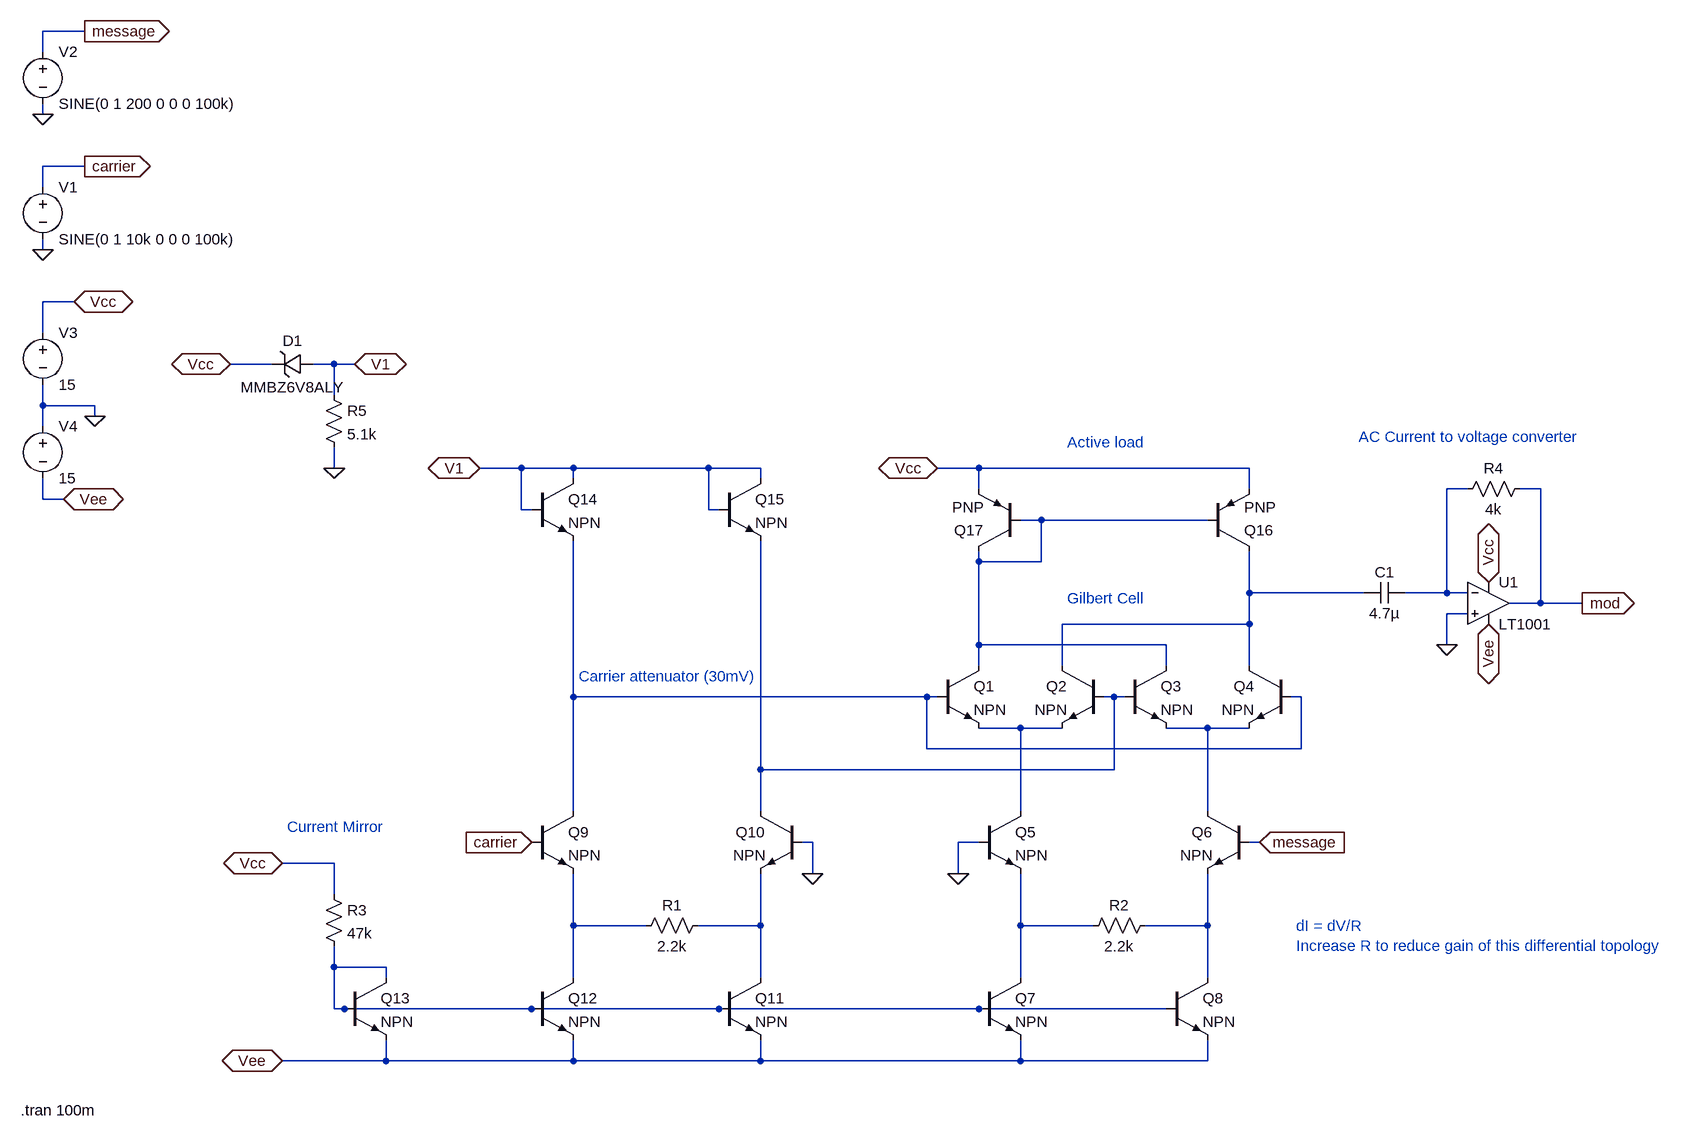
[diagram p0: schematic gilbert_cell_improved.asc]
gilbert_cell_improved.asc, the LTspice schematic file:
Version 4
SHEET 1 1336 812
WIRE -1152 -864 -1216 -864
WIRE -1216 -832 -1216 -864
WIRE -1216 -736 -1216 -752
WIRE -1152 -656 -1216 -656
WIRE -1216 -624 -1216 -656
WIRE -1216 -528 -1216 -544
WIRE -1168 -448 -1216 -448
WIRE -1216 -400 -1216 -448
WIRE -864 -352 -928 -352
WIRE -768 -352 -800 -352
WIRE -736 -352 -768 -352
WIRE -768 -304 -768 -352
WIRE -1216 -288 -1216 -320
WIRE -1136 -288 -1216 -288
WIRE -1136 -272 -1136 -288
WIRE -1216 -256 -1216 -288
WIRE -768 -192 -768 -224
WIRE -480 -192 -544 -192
WIRE -400 -192 -480 -192
WIRE -192 -192 -400 -192
WIRE -112 -192 -192 -192
WIRE 224 -192 160 -192
WIRE 640 -192 224 -192
WIRE -400 -176 -400 -192
WIRE -112 -176 -112 -192
WIRE 224 -160 224 -192
WIRE 640 -160 640 -192
WIRE 976 -160 944 -160
WIRE 1088 -160 1056 -160
WIRE -1216 -144 -1216 -176
WIRE -1184 -144 -1216 -144
WIRE -480 -128 -480 -192
WIRE -464 -128 -480 -128
WIRE -192 -128 -192 -192
WIRE -176 -128 -192 -128
WIRE 320 -112 288 -112
WIRE 576 -112 320 -112
WIRE 224 -48 224 -64
WIRE 320 -48 320 -112
WIRE 320 -48 224 -48
WIRE 640 0 640 -64
WIRE 816 0 640 0
WIRE 944 0 944 -160
WIRE 944 0 880 0
WIRE 976 0 944 0
WIRE 1088 16 1088 -160
WIRE 1088 16 1040 16
WIRE 1152 16 1088 16
WIRE 976 32 944 32
WIRE 640 48 640 0
WIRE 640 48 352 48
WIRE 224 80 224 -48
WIRE 512 80 224 80
WIRE 944 80 944 32
WIRE 224 112 224 80
WIRE 352 112 352 48
WIRE 512 112 512 80
WIRE 640 112 640 48
WIRE -400 160 -400 -80
WIRE 144 160 -400 160
WIRE 160 160 144 160
WIRE 432 160 416 160
WIRE 448 160 432 160
WIRE 720 160 704 160
WIRE 288 208 224 208
WIRE 352 208 288 208
WIRE 576 208 512 208
WIRE 640 208 576 208
WIRE 144 240 144 160
WIRE 720 240 720 160
WIRE 720 240 144 240
WIRE -112 272 -112 -80
WIRE 432 272 432 160
WIRE 432 272 -112 272
WIRE -400 336 -400 160
WIRE -112 336 -112 272
WIRE 288 336 288 208
WIRE 576 336 576 208
WIRE -32 384 -48 384
WIRE 224 384 192 384
WIRE 656 384 640 384
WIRE -768 416 -848 416
WIRE -32 432 -32 384
WIRE 192 432 192 384
WIRE -768 464 -768 416
WIRE -400 512 -400 432
WIRE -288 512 -400 512
WIRE -112 512 -112 432
WIRE -112 512 -208 512
WIRE 288 512 288 432
WIRE 400 512 288 512
WIRE 576 512 576 432
WIRE 576 512 480 512
WIRE -768 576 -768 544
WIRE -688 576 -768 576
WIRE -688 592 -688 576
WIRE -400 592 -400 512
WIRE -112 592 -112 512
WIRE 288 592 288 512
WIRE 576 592 576 512
WIRE -768 640 -768 576
WIRE -752 640 -768 640
WIRE -464 640 -752 640
WIRE -176 640 -464 640
WIRE 224 640 -176 640
WIRE 512 640 224 640
WIRE -688 720 -688 688
WIRE -688 720 -848 720
WIRE -400 720 -400 688
WIRE -400 720 -688 720
WIRE -112 720 -112 688
WIRE -112 720 -400 720
WIRE 288 720 288 688
WIRE 288 720 -112 720
WIRE 576 720 576 688
WIRE 576 720 288 720
FLAG -32 432 0
FLAG 192 432 0
FLAG -1136 -272 0
FLAG -1184 -144 Vee
IOPIN -1184 -144 BiDir
FLAG -1168 -448 Vcc
IOPIN -1168 -448 BiDir
FLAG -1216 -736 0
FLAG -1216 -528 0
FLAG -1152 -864 message
IOPIN -1152 -864 Out
FLAG -1152 -656 carrier
IOPIN -1152 -656 Out
FLAG -736 -352 V1
IOPIN -736 -352 BiDir
FLAG -544 -192 V1
IOPIN -544 -192 BiDir
FLAG 160 -192 Vcc
IOPIN 160 -192 BiDir
FLAG -848 720 Vee
IOPIN -848 720 BiDir
FLAG -848 416 Vcc
IOPIN -848 416 BiDir
FLAG 656 384 message
IOPIN 656 384 In
FLAG -464 384 carrier
IOPIN -464 384 In
FLAG 1008 -16 Vcc
IOPIN 1008 -16 BiDir
FLAG 1008 48 Vee
IOPIN 1008 48 BiDir
FLAG 944 80 0
FLAG 1152 16 mod
IOPIN 1152 16 Out
FLAG -768 -192 0
FLAG -928 -352 Vcc
IOPIN -928 -352 BiDir
SYMBOL npn 160 112 R0
SYMATTR InstName Q1
SYMBOL npn 416 112 M0
SYMATTR InstName Q2
SYMBOL npn 448 112 R0
SYMATTR InstName Q3
SYMBOL npn 704 112 M0
SYMATTR InstName Q4
SYMBOL npn 224 336 R0
SYMATTR InstName Q5
SYMBOL npn 640 336 M0
SYMATTR InstName Q6
SYMBOL npn 224 592 R0
SYMATTR InstName Q7
SYMBOL npn -464 336 R0
SYMATTR InstName Q9
SYMBOL npn -48 336 M0
SYMATTR InstName Q10
SYMBOL npn 512 592 R0
SYMATTR InstName Q8
SYMBOL npn -176 592 R0
SYMATTR InstName Q11
SYMBOL npn -464 592 R0
SYMATTR InstName Q12
SYMBOL npn -752 592 R0
SYMATTR InstName Q13
SYMBOL res -192 496 R90
WINDOW 0 0 56 VBottom 2
WINDOW 3 32 56 VTop 2
SYMATTR InstName R1
SYMATTR Value 2.2k
SYMBOL res 496 496 R90
WINDOW 0 0 56 VBottom 2
WINDOW 3 32 56 VTop 2
SYMATTR InstName R2
SYMATTR Value 2.2k
SYMBOL npn -464 -176 R0
SYMATTR InstName Q14
SYMBOL npn -176 -176 R0
SYMATTR InstName Q15
SYMBOL pnp 576 -64 M180
SYMATTR InstName Q16
SYMBOL pnp 288 -64 R180
SYMATTR InstName Q17
SYMBOL res -784 448 R0
SYMATTR InstName R3
SYMATTR Value 47k
SYMBOL voltage -1216 -640 R0
WINDOW 123 0 0 Left 0
WINDOW 39 0 0 Left 0
SYMATTR InstName V1
SYMATTR Value SINE(0 1 10k 0 0 0 100k)
SYMBOL voltage -1216 -416 R0
WINDOW 123 0 0 Left 0
WINDOW 39 0 0 Left 0
SYMATTR InstName V3
SYMATTR Value 15
SYMBOL voltage -1216 -272 R0
WINDOW 123 0 0 Left 0
WINDOW 39 0 0 Left 0
SYMATTR InstName V4
SYMATTR Value 15
SYMBOL voltage -1216 -848 R0
WINDOW 123 0 0 Left 0
WINDOW 39 0 0 Left 0
SYMATTR InstName V2
SYMATTR Value SINE(0 1 200 0 0 0 100k)
SYMBOL cap 880 -16 R90
WINDOW 0 0 32 VBottom 2
WINDOW 3 32 32 VTop 2
SYMATTR InstName C1
SYMATTR Value 4.7µ
SYMBOL OpAmps\\LT1001 1008 -48 R0
SYMATTR InstName U1
SYMBOL res 1072 -176 R90
WINDOW 0 0 56 VBottom 2
WINDOW 3 32 56 VTop 2
SYMATTR InstName R4
SYMATTR Value 4k
SYMBOL zener -800 -368 R90
WINDOW 0 -4 32 VBottom 2
WINDOW 3 36 32 VTop 2
SYMATTR InstName D1
SYMATTR Value MMBZ6V8ALY
SYMBOL res -784 -320 R0
SYMATTR InstName R5
SYMATTR Value 5.1k
TEXT -1250 796 Left 2 !.tran 100m
TEXT -840 360 Left 2 ;Current Mirror
TEXT -392 128 Left 2 ;Carrier attenuator (30mV)
TEXT 360 8 Left 2 ;Gilbert Cell
TEXT 360 -232 Left 2 ;Active load
TEXT 808 -240 Left 2 ;AC Current to voltage converter
TEXT 712 512 Left 2 ;dI = dV/R\nIncrease R to reduce gain of this differential topology

The netlist it stands for:
* gilbert_cell_improved.asc
Q1 N002 N004 N006 0 NPN
Q2 N003 N005 N006 0 NPN
Q3 N002 N005 N007 0 NPN
Q4 N003 N004 N007 0 NPN
Q5 N006 0 N010 0 NPN
Q6 N007 message N011 0 NPN
Q7 N010 N012 Vee 0 NPN
Q9 N004 carrier N008 0 NPN
Q10 N005 0 N009 0 NPN
Q8 N011 N012 Vee 0 NPN
Q11 N009 N012 Vee 0 NPN
Q12 N008 N012 Vee 0 NPN
Q13 N012 N012 Vee 0 NPN
R1 N009 N008 2.2k
R2 N011 N010 2.2k
Q14 V1 V1 N004 0 NPN
Q15 V1 V1 N005 0 NPN
Q16 N003 N002 Vcc 0 PNP
Q17 N002 N002 Vcc 0 PNP
R3 Vcc N012 47k
V1 carrier 0 SINE(0 1 10k 0 0 0 100k)
V3 Vcc 0 15
V4 0 Vee 15
V2 message 0 SINE(0 1 200 0 0 0 100k)
C1 N001 N003 4.7µ
XU1 0 N001 Vcc Vee mod LT1001  ; pins In+ In- V+ V- OUT
R4 mod N001 4k
D1 V1 Vcc MMBZ6V8ALY
R5 V1 0 5.1k
.model D D
.lib standard.dio
.model NPN NPN
.model PNP PNP
.lib standard.bjt
.tran 100m
* Current Mirror
* Carrier attenuator (30mV)
* Gilbert Cell
* Active load
* AC Current to voltage converter
* dI = dV/R
* Increase R to reduce gain of this differential topology
.lib LTC.lib
.backanno
.end